# Altium schematic sheet Sheet3.SchDoc
size 420 x 297 mm; SheetNumber: 3; ЕСКД_Децимальний_номер: ААЭД.468224.ххх Э3; ЕСКД_Лист: 3; PageSetup: Record=PageOptions|CenterHorizontal=True|CenterVertical=True|PrintScale=0.70|XCorrection=1.00|YCorrection=1.00|PrintKind=1|BorderSize=5000000|LeftOffset=0|BottomOffset=0|Orientation=2|PaperLength=1000|PaperWidth=1000|Scale=100|PaperSource=7|PrintQuality=600|MediaType=1|DitherType=10|PrintScaleMode=1|PaperKind=A4|PaperIndex=9; DecimalNumber: АЧАД.468224.ххх Э3; HeadOfSector: Нач. сектора; MainDevice: Перв.примен.; Name: Наименование; DecimalNumber_MIRROR: 3Э ххх.422864.ДАЧА
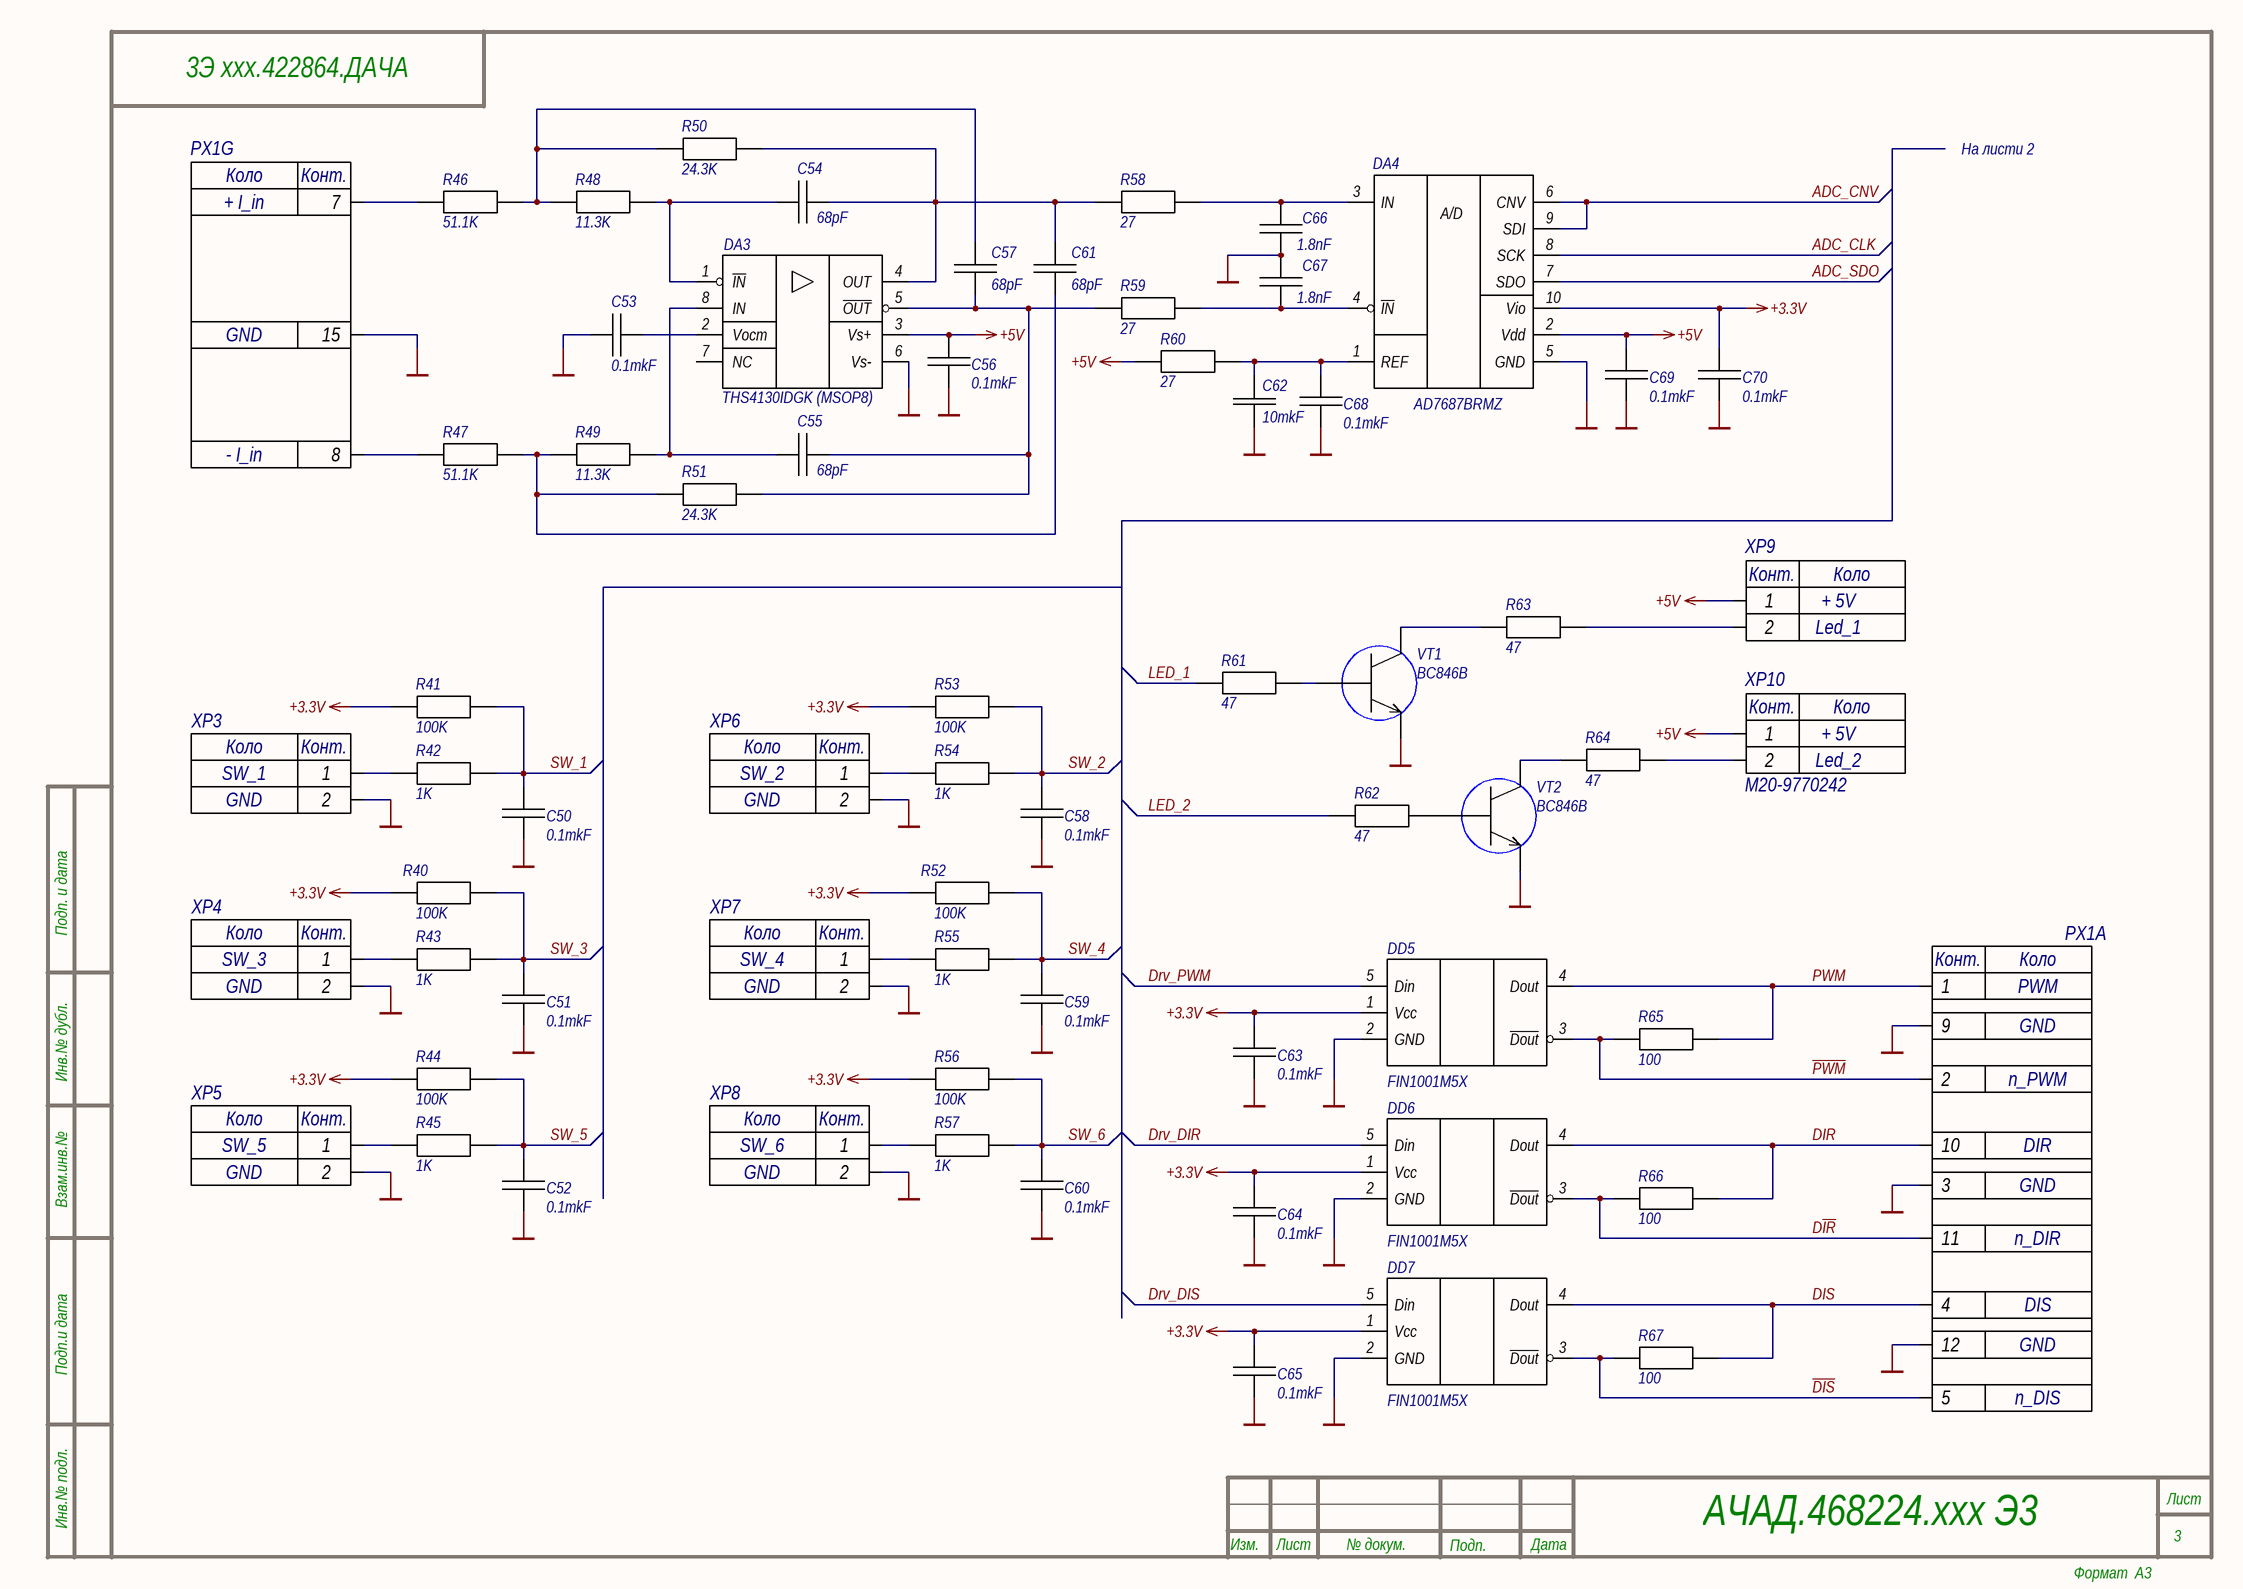
[diagram p0: Sheet3.SchDoc]

## Parts
C50  0.1mkF  [C_0603]
C51  0.1mkF  [C_0603]
C52  0.1mkF  [C_0603]
C53  0.1mkF  [C_0603]
C54  68pF  [C_0603]
C55  68pF  [C_0603]
C56  0.1mkF  [C_0603]
C57  68pF  [C_0603]
C58  0.1mkF  [C_0603]
C59  0.1mkF  [C_0603]
C60  0.1mkF  [C_0603]
C61  68pF  [C_0603]
C62  10mkF  [C_1206]
C63  0.1mkF  [C_0603]
C64  0.1mkF  [C_0603]
C65  0.1mkF  [C_0603]
C66  1.8nF  [C_0603]
C67  1.8nF  [C_0603]
C68  0.1mkF  [C_0603]
C69  0.1mkF  [C_0603]
C70  0.1mkF  [C_0603]
DA3  THS4130IDGK (MSOP8)  [THS4130IDGK(MSOP8)]
DA4  AD7687BRMZ
DD5  FIN1001M5X
DD6  FIN1001M5X
DD7  FIN1001M5X
PX1  DB_15  (value not drawn)  (parts A,B,C,D,E,G,H,I,J,K,L,O of 15)
R40  100K  [R_0603]
R41  100K  [R_0603]
R42  1K  [R_0603]
R43  1K  [R_0603]
R44  100K  [R_0603]
R45  1K  [R_0603]
R46  51.1K  [R_0603]
R47  51.1K  [R_0603]
R48  11.3K  [R_0603]
R49  11.3K  [R_0603]
R50  24.3K  [R_0603]
R51  24.3K  [R_0603]
R52  100K  [R_0603]
R53  100K  [R_0603]
R54  1K  [R_0603]
R55  1K  [R_0603]
R56  100K  [R_0603]
R57  1K  [R_0603]
R58  27  [R_0603]
R59  27  [R_0603]
R60  27  [R_0603]
R61  47  [R_0603]
R62  47  [R_0603]
R63  47  [R_0603]
R64  47  [R_0603]
R65  100  [R_0603]
R66  100  [R_0603]
R67  100  [R_0603]
VT1  BC846B  [SOT95P245X110 3N]
VT2  BC846B  [SOT95P245X110 3N]
XP3  M20-9770242  (value not drawn)
XP4  M20-9770242  (value not drawn)
XP5  M20-9770242  (value not drawn)
XP6  M20-9770242  (value not drawn)
XP7  M20-9770242  (value not drawn)
XP8  M20-9770242  (value not drawn)
XP9  M20-9770242  (value not drawn)
XP10  M20-9770242

## Nets
+3.3V: C63.1 C64.1 C65.1 C70.1 DA4.10(Vio) DD5.1(Vcc) DD6.1(Vcc) DD7.1(Vcc) R40.1 R41.1 R44.1 R52.1 R53.1 R56.1
+5V: C56.1 C69.1 DA3.3(Vs+) DA4.2(Vdd) R60.1 XP9.1 XP10.1
GND: C50.2 C51.2 C52.2 C53.1 C56.2 C58.2 C59.2 C60.2 C62.1 C63.2 C64.2 C65.2 C66.2 C67.1 C68.2 C69.2 C70.2 DA3.6(Vs-) DA4.5(GND) DD5.2(GND) DD6.2(GND) DD7.2(GND) PX1.3 PX1.9 PX1.12 PX1.15 VT1.2 VT2.2 XP3.2 XP4.2 XP5.2 XP6.2 XP7.2 XP8.2
ADC_CLK: DA4.8(SCK)
ADC_CNV: DA4.6(CNV) DA4.9(SDI)
ADC_SDO: DA4.7(SDO)
~{DIS}: DD7.3(~{Dout}) PX1.5 R67.1
D~{I}~{R}: DD6.3(~{Dout}) PX1.11 R66.1
DIR: DD6.4(Dout) PX1.10 R66.2
DIS: DD7.4(Dout) PX1.4 R67.2
Drv_DIR: DD6.5(Din)
Drv_DIS: DD7.5(Din)
Drv_PWM: DD5.5(Din)
LED_1: R61.1
LED_2: R62.1
~{PWM}: DD5.3(~{Dout}) PX1.1(2) R65.1
PWM: DD5.4(Dout) PX1.1 R65.2
SW_1: C50.1 R41.2 R42.2
SW_2: C58.1 R53.2 R54.2
SW_3: C51.1 R40.2 R43.2
SW_4: C59.1 R52.2 R55.2
SW_5: C52.1 R44.2 R45.2
SW_6: C60.1 R56.2 R57.2
NetC53_2: C53.2 DA3.2(Vocm)
NetC54_1: C54.1 C61.1 DA3.4(OUT) R50.2 R58.1
NetC54_2: C54.2 DA3.1(~{IN}) R48.2
NetC55_1: C55.1 C57.2 DA3.5(~{OUT}) R51.1 R59.1
NetC55_2: C55.2 DA3.8(IN) R49.1
NetC57_1: C57.1 R46.2 R48.1 R50.1
NetC61_2: C61.2 R47.2 R49.2 R51.2
NetC62_2: C62.2 C68.1 DA4.1(REF) R60.2
NetC66_1: C66.1 DA4.3(IN) R58.2
NetC67_2: C67.2 DA4.4(~{IN}) R59.2
NetPX1_7: PX1.7 R46.1
NetPX1_8: PX1.8 R47.1
NetR42_1: R42.1 XP3.1
NetR43_1: R43.1 XP4.1
NetR45_1: R45.1 XP5.1
NetR54_1: R54.1 XP6.1
NetR55_1: R55.1 XP7.1
NetR57_1: R57.1 XP8.1
NetR61_2: R61.2 VT1.1
NetR62_2: R62.2 VT2.1
NetR63_1: R63.1 VT1.3
NetR63_2: R63.2 XP9.2
NetR64_1: R64.1 VT2.3
NetR64_2: R64.2 XP10.2

Not connected (* = marked no-connect by the designer): DA3 7(NC)

## Notes on the sheet
- Коло
- (near PX1) Конт.
- На листи 2
- + I_in
- GND
- - I_in
- + 5V
- Led_1
- SW_1
- SW_2
- Led_2
- SW_3
- SW_4
- PWM
- n_PWM
- SW_5
- SW_6
- DIR
- n_DIR
- DIS
- n_DIS
- Подп. и дата
- Инв.№ дубл.
- Взам.инв.№
- Подп.и дата
- Инв.№ подл.
- Изм.
- Лист
- № докум.
- Подп.
- Дата
- Формат  A3
- (in symbol AD7687BRMZ) A/D
- (in symbol M20-9770242) Конт.; Коло

## Library data of the parts
C50-C61 C63-C70 = C_0.1mkF_0603
  C50-C53 C56 C58-C60 C63-C65 C68-C70: Value: 0.1mkF
  C54 C55 C57 C61: Value: 68pF
  C66 C67: Value: 1.8nF
C62 = C_10mkF_1206: Value: 10mkF
R40-R67 = R_100_0603
  R40 R41 R44 R52 R53 R56: Value: 100K
  R42 R43 R45 R54 R55 R57: Value: 1K
  R46 R47: Value: 51.1K
  R48 R49: Value: 11.3K
  R50 R51: Value: 24.3K
  R58-R60: Value: 27
  R61-R64: Value: 47
  R65-R67: Value: 100